# Altium schematic sheet Main.SchDoc: LoRaBug Main
size A3; Author: Craig Hesling; DrawnBy: Craig Hesling; Revision: 3
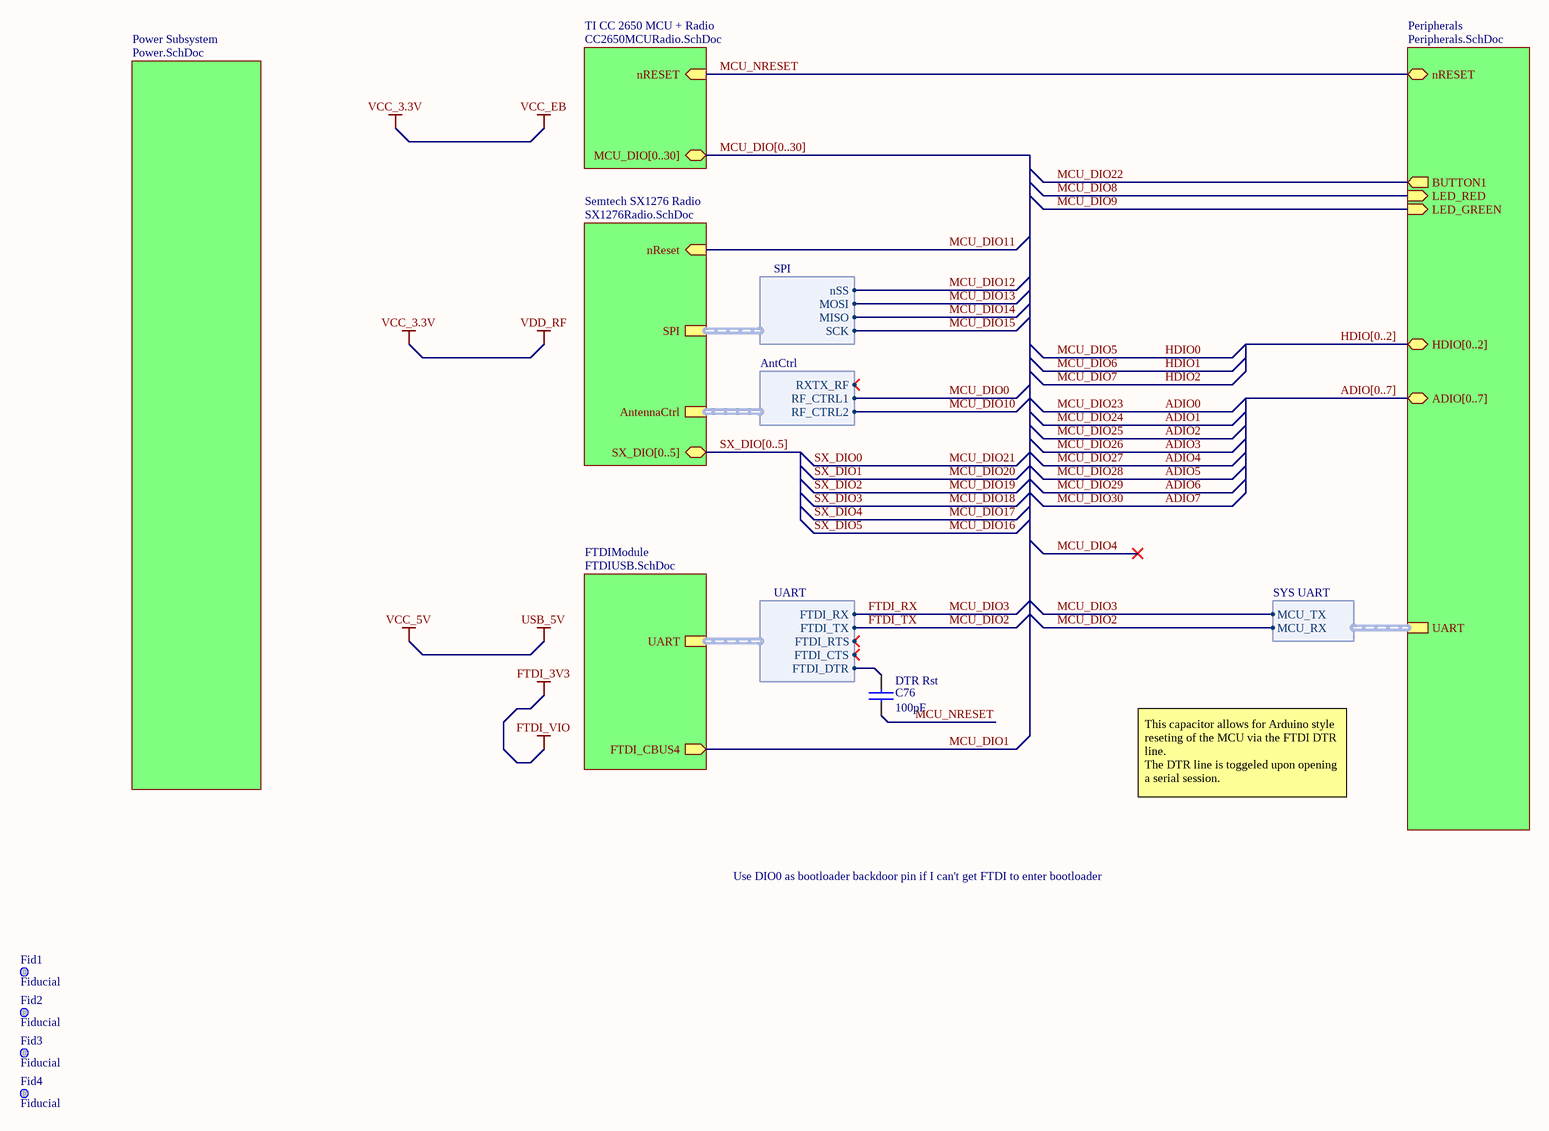
[diagram p0: Main.SchDoc]

## Parts
C76  DTR Rst  value 100pF  [CAPC0402(1005)60_N]
Fid1  Fiducial  [Fiducial]
Fid2  Fiducial  [Fiducial]
Fid3  Fiducial  [Fiducial]
Fid4  Fiducial  [Fiducial]

## Sub-sheets
FTDIModule = FTDIUSB.SchDoc: UART (harness UART), FTDI_CBUS4 (out)
Peripherals = Peripherals.SchDoc: BUTTON1 (out), LED_RED (in), LED_GREEN (in), nRESET (bidir), ADIO[0..7] (bidir), HDIO[0..2] (bidir), UART (harness SYS UART)
Power Subsystem = Power.SchDoc: no entries
Semtech SX1276 Radio = SX1276Radio.SchDoc: SPI (harness SPI), nReset (in), AntennaCtrl (harness AntCtrl), SX_DIO[0..5] (bidir)
TI CC 2650 MCU + Radio = CC2650MCURadio.SchDoc: MCU_DIO[0..30] (bidir), nRESET (in)

## Harnesses
UART: FTDI_RX, FTDI_TX, FTDI_CTS, FTDI_RTS, FTDI_DTR
SPI: SCK, nSS, MOSI, MISO
AntCtrl: RF_CTRL1, RF_CTRL2, RXTX_RF
SYS UART: MCU_TX, MCU_RX

## Nets
FTDI_RX: sheet FTDIModule/UART.FTDI_RX, sheet Peripherals/UART.MCU_TX  [also labelled MCU_DIO3]
FTDI_TX: sheet FTDIModule/UART.FTDI_TX, sheet Peripherals/UART.MCU_RX  [also labelled MCU_DIO2]
MCU_DIO0: sheet Semtech SX1276 Radio/AntennaCtrl.RF_CTRL1
MCU_DIO1: sheet FTDIModule/FTDI_CBUS4
MCU_DIO8: sheet Peripherals/LED_RED
MCU_DIO9: sheet Peripherals/LED_GREEN
MCU_DIO10: sheet Semtech SX1276 Radio/AntennaCtrl.RF_CTRL2
MCU_DIO11: sheet Semtech SX1276 Radio/nReset
MCU_DIO12: sheet Semtech SX1276 Radio/SPI.nSS
MCU_DIO13: sheet Semtech SX1276 Radio/SPI.MOSI
MCU_DIO14: sheet Semtech SX1276 Radio/SPI.MISO
MCU_DIO15: sheet Semtech SX1276 Radio/SPI.SCK
MCU_DIO22: sheet Peripherals/BUTTON1
MCU_NRESET: C76.1 ; sheet TI CC 2650 MCU + Radio/nRESET, sheet Peripherals/nRESET
NetC76_2: C76.2 ; sheet FTDIModule/UART.FTDI_DTR

## Buses and harness runs
bus ADIO[0..7] = sheet Peripherals/ADIO[0..7]
bus HDIO[0..2] = sheet Peripherals/HDIO[0..2]
bus MCU_DIO[0..30] = sheet TI CC 2650 MCU + Radio/MCU_DIO[0..30]
bus SX_DIO[0..5] = sheet Semtech SX1276 Radio/SX_DIO[0..5]

## Notes on the sheet
- This capacitor allows for Arduino style reseting of the MCU via the FTDI DTR line.
  The DTR line is toggeled upon opening a serial session.
- Use DIO0 as bootloader backdoor pin if I can't get FTDI to enter bootloader

## Library data of the parts
C76 = CAPACITOR
Fid1-Fid4 = Fiducial: Fiducial mark from Patrick's library